# EAGLE design particle-can-v3.0 (EAGLE 7.5.0)
DATABASE: /home/monkbroc/Electronics/eagle/PARTSDB.tsv
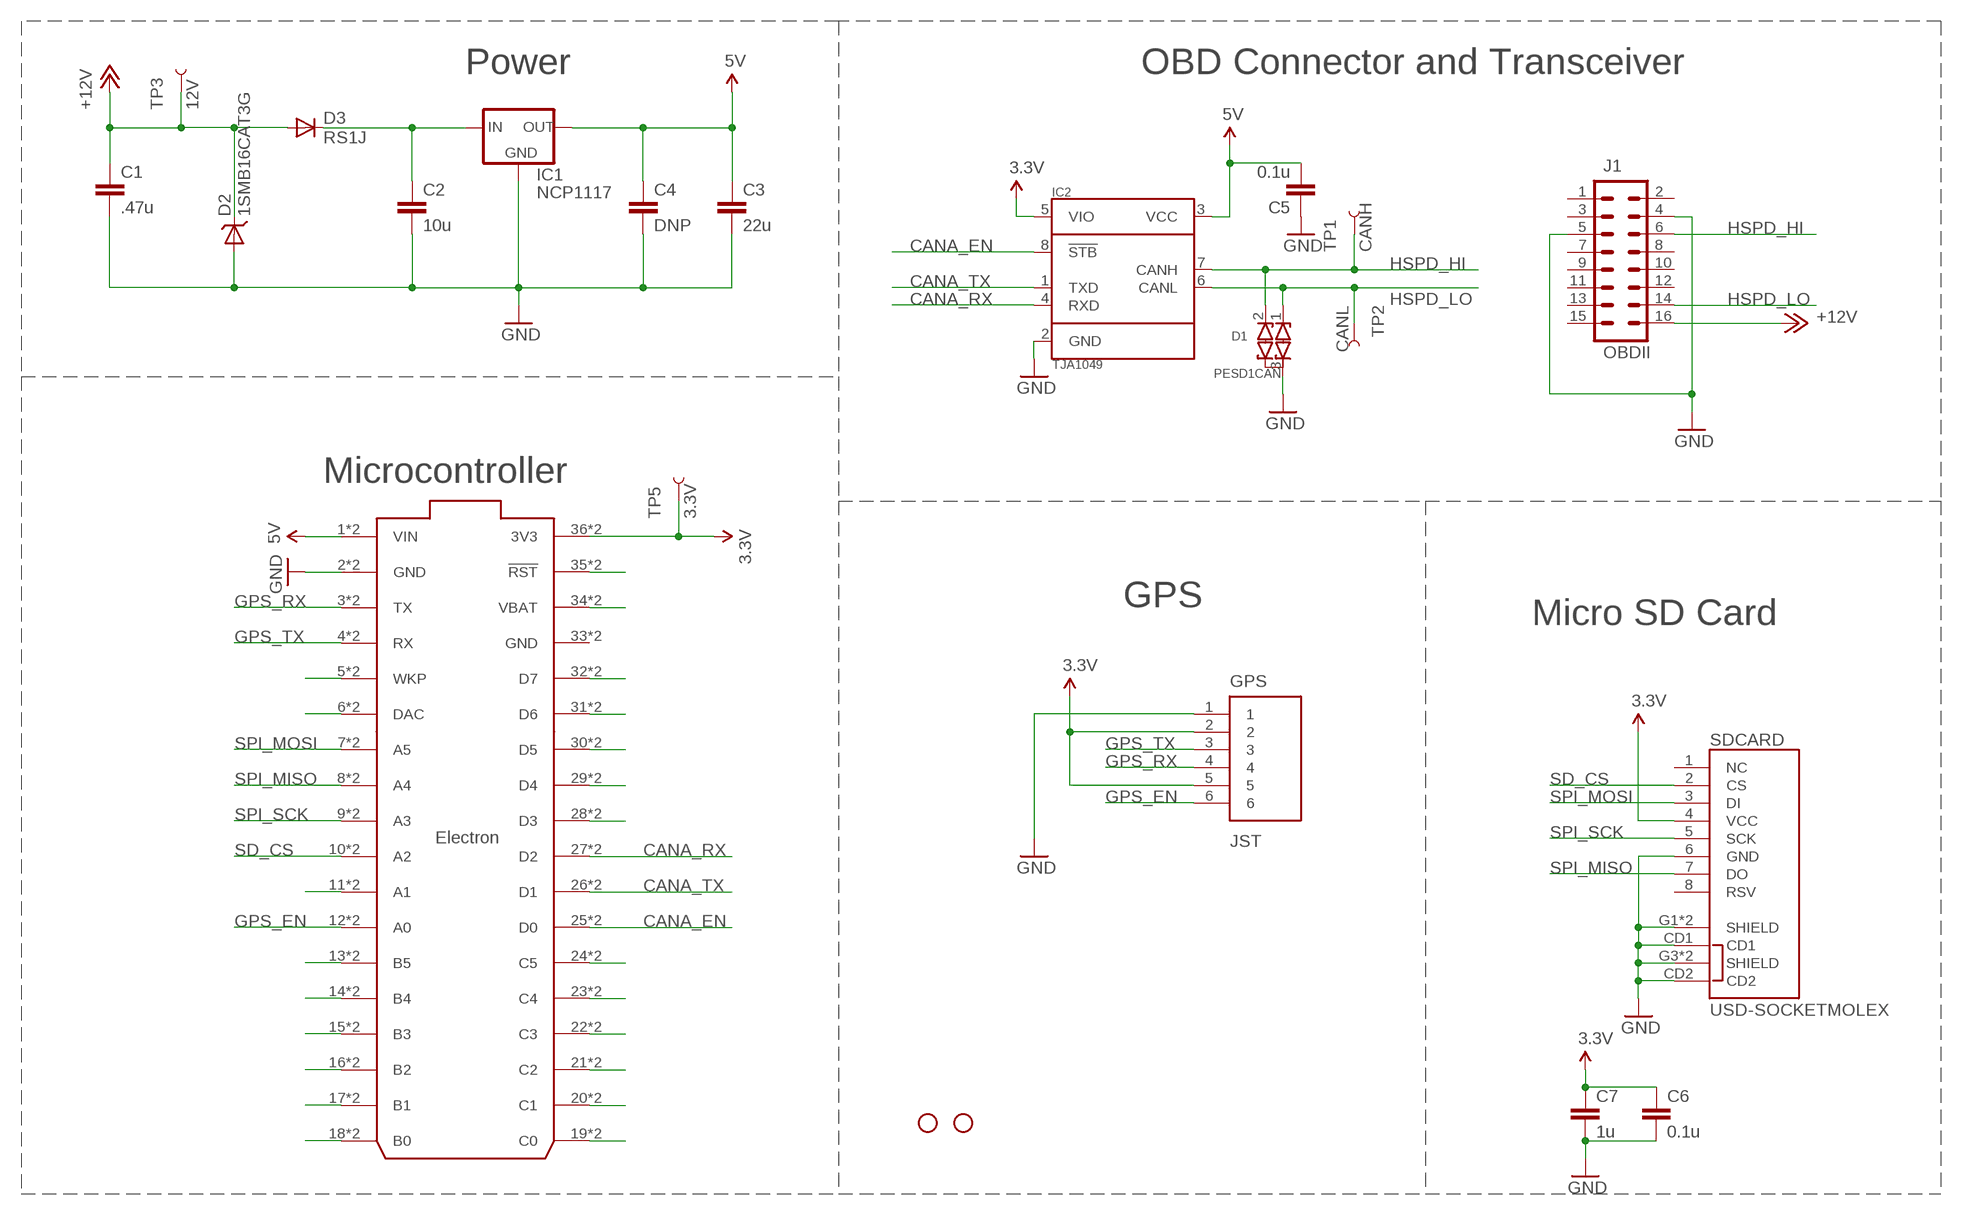
[diagram p0: schematic, sheet 1]

## Parts
C1  .47u  C-EUC0805  [C0805]
C2  10u  C-EUC0805  [C0805]
C3  22u  C-EUC0805  [C0805]
C4  DNP  C-EUC0805  [C0805]
C5  0.1u  C-EUC0805  [C0805]
C6  0.1u  C-EUC0805  [C0805]
C7  1u  C-EUC0805  [C0805]
D1  PESD1CAN  DIODE_ESD_DUAL-SOT-23  [SOT23]
D2  1SMB16CAT3G  DIODE-TVS-SMB  [SMB-DIODE]
D3  RS1J  DIODESMA  [SMA-DIODE]
ELECTRON  ELECTRON_WITH_EXTERNAL_HEADERS  [ELECTRON_EXTERNAL]
GPS  JST  [JST-6-SMD-VERT-1.0MM]
IC1  NCP1117  [SOT223]
IC2  TJA1049  [SO8]
J1  OBDII  M08X2-OBDII-COMTECH  [OBDII-COMTECH]
SDCARD  USD-SOCKETMOLEX  [MICRO-SD-MOLEX]
STANDOFF1  STAND-OFF  [STAND-OFF]
STANDOFF2  STAND-OFF  [STAND-OFF]
TP1  CANH  TEST-POINT3  [PAD.03X.03]
TP2  CANL  TEST-POINT3  [PAD.03X.03]
TP3  12V  TEST-POINT3  [PAD.03X.03]
TP5  3.3V  TEST-POINT3  [PAD.03X.03]

## Nets
3.3V: C6.1 C7.1 ELECTRON.36(3V3) ELECTRON.@36(3V3) GPS.2 GPS.5 IC2.5(VIO) SDCARD.4(VCC) TP5.P$1
5V [power]: C3.1 C4.1 C5.2 ELECTRON.1(VIN) ELECTRON.@1(VIN) IC1.3(OUT) IC1.4(OUT) IC2.3(VCC)
+12V [power]: C1.1 D2.C D3.A J1.16 TP3.P$1
CANA_EN: ELECTRON.25(D0) ELECTRON.@25(D0) IC2.8(!STB)
CANA_RX: ELECTRON.27(D2) ELECTRON.@27(D2) IC2.4(RXD)
CANA_TX: ELECTRON.26(D1) ELECTRON.@26(D1) IC2.1(TXD)
GND: C1.2 C2.2 C3.2 C4.2 C5.1 C6.2 C7.2 D1.3(COM) D2.A ELECTRON.2(GND) ELECTRON.@2(GND) GPS.1 IC1.1(GND) IC2.2(GND) J1.4 J1.5 SDCARD.6(GND) SDCARD.CD1 SDCARD.CD2 SDCARD.G1(SHIELD) SDCARD.G2(SHIELD) SDCARD.G3(SHIELD) SDCARD.G4(SHIELD)
GPS_EN: ELECTRON.12(A0) ELECTRON.@12(A0) GPS.6
GPS_RX: ELECTRON.3(TX) ELECTRON.@3(TX) GPS.4
GPS_TX: ELECTRON.4(RX) ELECTRON.@4(RX) GPS.3
HSPD_HI: D1.2(C2) IC2.7(CANH) J1.6 TP1.P$1
HSPD_LO: D1.1(C1) IC2.6(CANL) J1.14 TP2.P$1
N$1: ELECTRON.13(B5) ELECTRON.@13(B5)
N$7: ELECTRON.14(B4) ELECTRON.@14(B4)
N$10: ELECTRON.35(!RST) ELECTRON.@35(!RST)
N$11: ELECTRON.34(VBAT) ELECTRON.@34(VBAT)
N$12: ELECTRON.32(D7) ELECTRON.@32(D7)
N$13: ELECTRON.31(D6) ELECTRON.@31(D6)
N$14: ELECTRON.30(D5) ELECTRON.@30(D5)
N$15: ELECTRON.29(D4) ELECTRON.@29(D4)
N$16: ELECTRON.28(D3) ELECTRON.@28(D3)
N$17: ELECTRON.15(B3) ELECTRON.@15(B3)
N$18: ELECTRON.11(A1) ELECTRON.@11(A1)
N$19: ELECTRON.16(B2) ELECTRON.@16(B2)
N$20: ELECTRON.17(B1) ELECTRON.@17(B1)
N$21: ELECTRON.18(B0) ELECTRON.@18(B0)
N$22: ELECTRON.19(C0) ELECTRON.@19(C0)
N$23: ELECTRON.20(C1) ELECTRON.@20(C1)
N$24: ELECTRON.21(C2) ELECTRON.@21(C2)
N$25: ELECTRON.6(DAC) ELECTRON.@6(DAC)
N$26: ELECTRON.5(WKP) ELECTRON.@5(WKP)
N$27: ELECTRON.23(C4) ELECTRON.@23(C4)
N$28: ELECTRON.24(C5) ELECTRON.@24(C5)
N$29: ELECTRON.22(C3) ELECTRON.@22(C3)
N$31 [power]: C2.1 D3.C IC1.2(IN)
SD_CS: ELECTRON.10(A2) ELECTRON.@10(A2) SDCARD.2(CS)
SPI_MISO: ELECTRON.8(A4) ELECTRON.@8(A4) SDCARD.7(DO)
SPI_MOSI: ELECTRON.7(A5) ELECTRON.@7(A5) SDCARD.3(DI)
SPI_SCK: ELECTRON.9(A3) ELECTRON.@9(A3) SDCARD.5(SCK)
Unconnected: J1.1 J1.2 J1.3 J1.7 J1.8 J1.9 J1.10 J1.11 J1.12 J1.13 J1.15 SDCARD.1(NC) SDCARD.8(RSV)

## Notes on the sheet
- Power | OBD Connector and Transceiver
- Microcontroller
- GPS
- Micro SD Card

## Power pins joined to a net without a drawn wire
GND: ELECTRON.33(GND) ELECTRON.@33(GND)

## Library data of the parts
C1 = rcl:C-EU: CAPACITOR, European symbol; PARTNO: C0805C474K5RACTU
C2 = rcl:C-EU: CAPACITOR, European symbol; PARTNO: GRM21BR6YA106KE43L
C3 C4 = rcl:C-EU: CAPACITOR, European symbol; PARTNO: GRM219R61A226MEA0D
C5 C6 = rcl:C-EU: CAPACITOR, European symbol; PARTNO: 08055C104KAT2A
C7 = rcl:C-EU: CAPACITOR, European symbol; PARTNO: CC0805KKX7R7BB105
D1 = MuniRent:DIODE_ESD_DUAL: Dual ESD Diode, with a common anode; PARTNO: PESD1CAN-215
D2 = BUG:DIODE-TVS; PARTNO: 1SMB16CAT3G; ROLE: Overvoltage protection
D3 = BUG:DIODE: Diode These are standard reverse protection diodes and small signal diodes. SMA package can handle up to about 1A. SOD-323 can handle about 200mA. What the SOD-323 package when ordering, there are some mfgs out there that are 5-pin packages.; PARTNO: RS1J-E3/5AT; ROLE: Reverse protection
ELECTRON = MuniRent:ELECTRON; PARTNO: PPTC181LFBN-RC
GPS = MuniRent:JST; PARTNO: BM06B-SRSS-TB; PROD_ID: CONN-08249
IC1 = MuniRent:NCP1117; PARTNO: NCP1117LPST50T3G
IC2 = MuniRent:TJA1049; PARTNO: TJA1049T-118
J1 = MuniRent:M08X2: .1" headers, two rows of 8 each; PARTNO: OBD-II
SDCARD = MuniRent:USD-SOCKET: microSD Socket Push-push type uSD socket. Schematic element and footprint production proven. Spark Fun Electronics SKU : PRT-00127. tDoc lines correctly indicate media card edge positions when inserting (unlocked, locked, depressed). NOTE: CD1 and CD2 are connected internally; PARTNO: 1040310811
STANDOFF1 STANDOFF2 = SparkFun-Electromechanical:STAND-OFF: #4 Stand Off This is the mechanical footprint for a #4 phillips button head screw. Use the keepout ring to avoid running the screw head into surrounding components. SKU : PRT-00447
TP1-TP3 TP5 = SparkFun-Passives:TEST-POINT: Bare copper test points for troubleshooting or ICT

## Net classes
0 default: width 0.254 mm
1 power: width 0.813 mm, clearance 0.406 mm

## Board
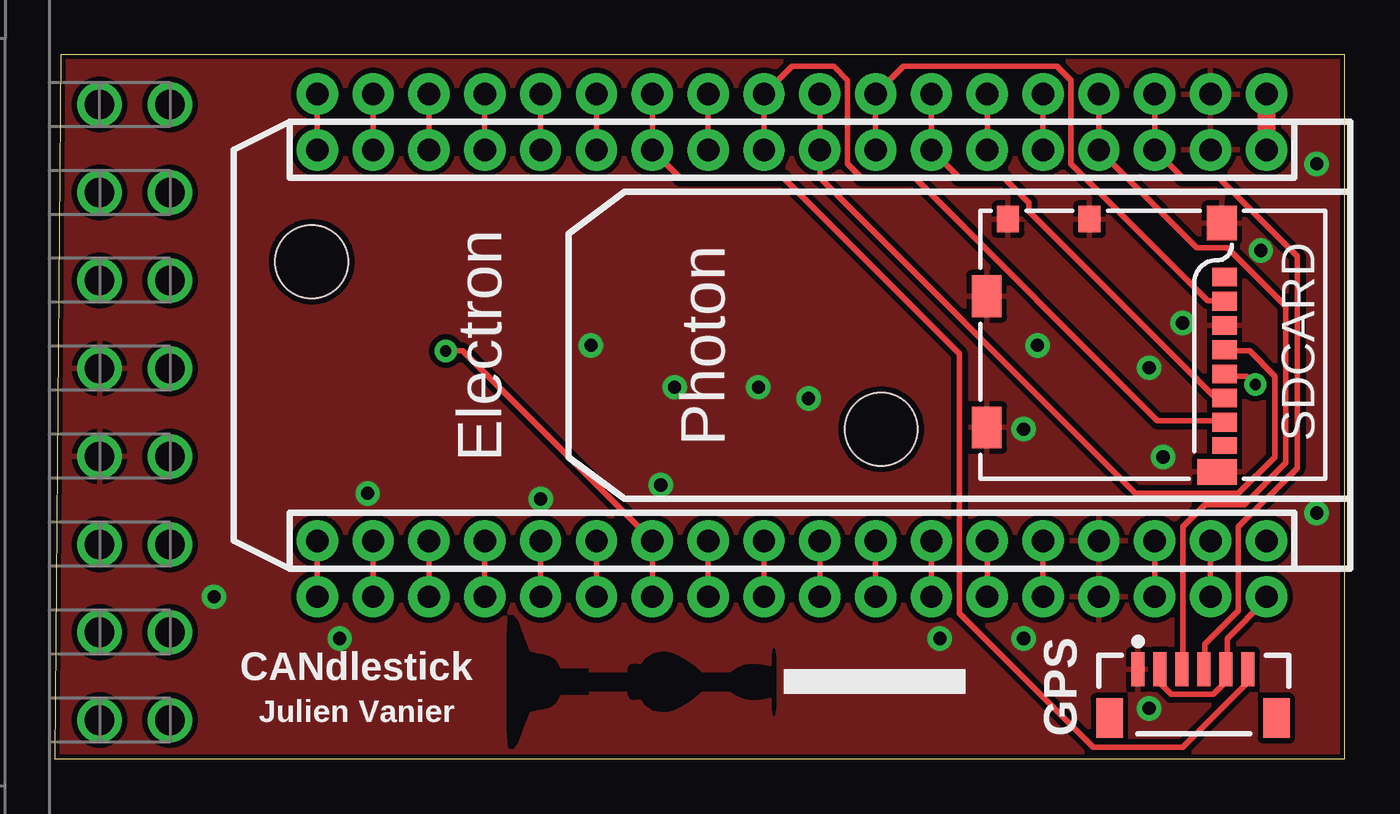
[diagram p1: board, top side]
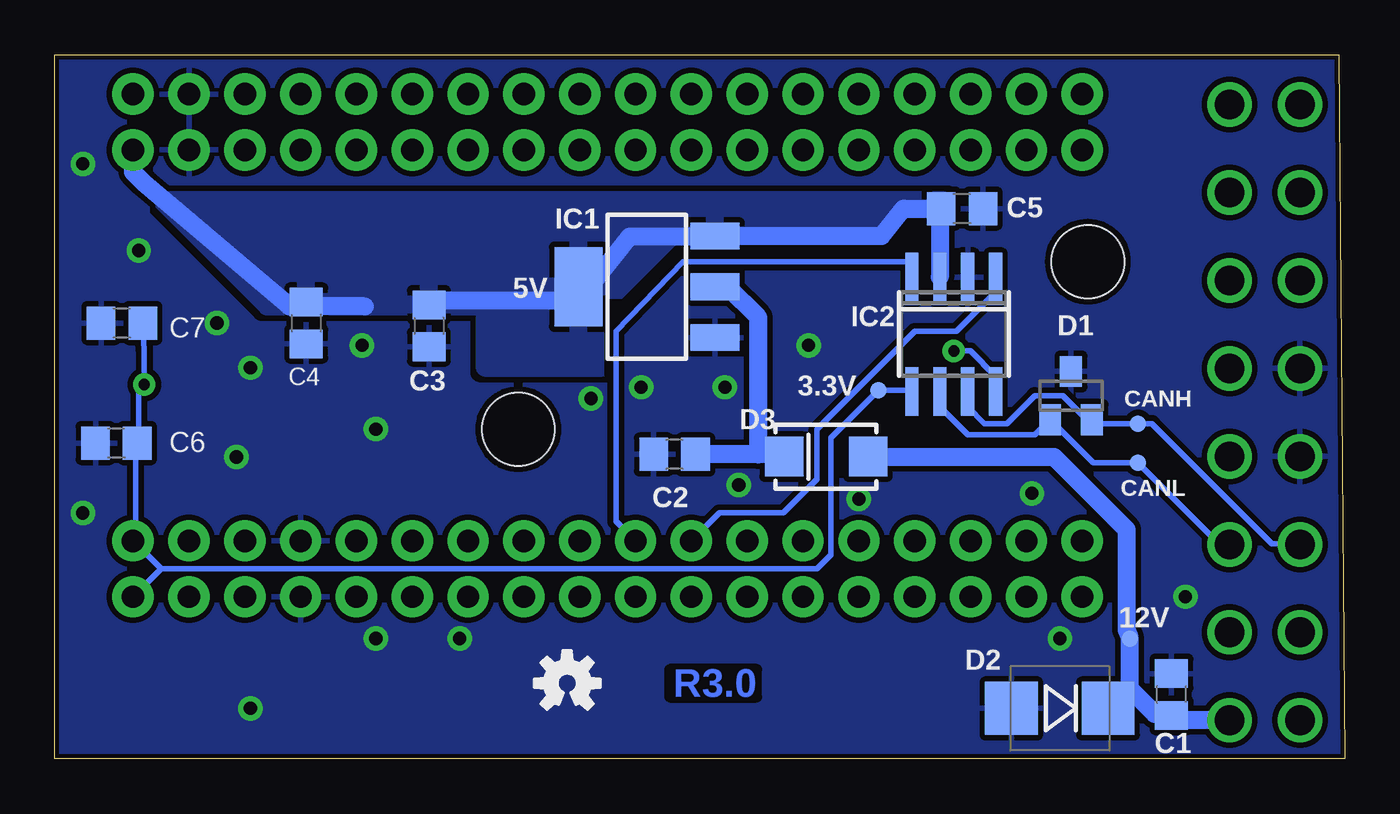
[diagram p2: board, bottom side, seen from below]

Size 58.67 x 32 mm. Coordinates in mm from the lower left corner, seen from the top.
Outline: 0,0 58.67,0 58.67,32 0.25,32 0,0
Copper layers (1*16): Top 0.035mm / dielectric 1.5mm / Bottom 0.035mm
Design rules "SparkFun *": minimum track width 8mil, minimum drill 20mil, track to track 10mil, track to pad 8mil, pad to pad 10mil, via to via 10mil, smd to smd 10mil, copper to edge 8mil, drill to drill 8mil, minimum pad ring 12mil, minimum via ring 10mil, stop-mask expansion 4mil, vias tented up to drill 45mil, thermal gap 10mil
tRestrict: area 20.5,0.4 to 32.8,6.5

### Footprints (pad centres in the part's own frame; a part is rotated, then mirrored left to right if it is on the bottom)
C0805 = smd 1.3 x 1.5: 1 -0.95,0; 2 0.95,0
SOT23 = smd 1 x 1.4: 1 -0.95,-1.1; 2 0.95,-1.1; 3 0,1.1
SMB-DIODE = smd 2.4 x 2.4: A 2.2,0; C -2.2,0
SMA-DIODE = smd 1.75 x 1.8: A -1.91,0; C 1.91,0
ELECTRON_EXTERNAL = drill 1.016 pad 1.88: 1 1.27,46.99; 2 1.27,44.45; 3 1.27,41.91; 4 1.27,39.37; 5 1.27,36.83; 6 1.27,34.29; 7 1.27,31.75; 8 1.27,29.21; 9 1.27,26.67; 10 1.27,24.13; 11 1.27,21.59; 12 1.27,19.05; 13 1.27,16.51; 14 1.27,13.97; 15 1.27,11.43; 16 1.27,8.89; 17 1.27,6.35; 18 1.27,3.81; 19 19.05,3.81; 20 19.05,6.35; 21 19.05,8.89; 22 19.05,11.43; 23 19.05,13.97; 24 19.05,16.51; 25 19.05,19.05; 26 19.05,21.59; 27 19.05,24.13; 28 19.05,26.67; 29 19.05,29.21; 30 19.05,31.75; 31 19.05,34.29; 32 19.05,36.83; 33 19.05,39.37; 34 19.05,41.91; 35 19.05,44.45; 36 19.05,46.99; @1 -1.27,46.99; @2 -1.27,44.45; @3 -1.27,41.91; @4 -1.27,39.37; @5 -1.27,36.83; @6 -1.27,34.29; @7 -1.27,31.75; @8 -1.27,29.21; @9 -1.27,26.67; @10 -1.27,24.13; @11 -1.27,21.59; @12 -1.27,19.05; @13 -1.27,16.51; @14 -1.27,13.97; @15 -1.27,11.43; @16 -1.27,8.89; @17 -1.27,6.35; @18 -1.27,3.81; @19 21.59,3.81; @20 21.59,6.35; @21 21.59,8.89; @22 21.59,11.43; @23 21.59,13.97; @24 21.59,16.51; @25 21.59,19.05; @26 21.59,21.59; @27 21.59,24.13; @28 21.59,26.67; @29 21.59,29.21; @30 21.59,31.75; @31 21.59,34.29; @32 21.59,36.83; @33 21.59,39.37; @34 21.59,41.91; @35 21.59,44.45; @36 21.59,46.99
JST-6-SMD-VERT-1.0MM = smd 0.6 x 1.55: 1 -2.54,1.27; 2 -1.54,1.27; 3 -0.54,1.27; 4 0.46,1.27; 5 1.46,1.27; 6 2.46,1.27 | smd 1.2 x 1.8: P$1 -3.84,-0.955; P$2 3.76,-0.955
SOT223 = smd 1.219 x 2.235: 1 -2.311,-3.099; 2 0,-3.099; 3 2.311,-3.099 | smd 3.6 x 2.2: 4 0,3.099
SO8 = smd 0.6 x 2.2: 1 -1.905,-2.6; 2 -0.635,-2.6; 3 0.635,-2.6; 4 1.905,-2.6; 5 1.905,2.6; 6 0.635,2.6; 7 -0.635,2.6; 8 -1.905,2.6
OBDII-COMTECH = drill 1.346: 1 -14,0; 2 -10,0; 3 -6,0; 4 -2,0; 5 2,0; 6 6,0; 7 10,0; 8 14,0; 9 -14,3.2; 10 -10,3.2; 11 -6,3.2; 12 -2,3.2; 13 2,3.2; 14 6,3.2; 15 10,3.2; 16 14,3.2
MICRO-SD-MOLEX = smd 0.75 x 1.1: 1 -4.545,0.25 | smd 0.85 x 1.1: 2 -3.495,0.25; 3 -2.395,0.25; 4 -1.295,0.25; 5 -0.195,0.25; 6 0.905,0.25; 7 2.005,0.25; 8 3.105,0.25 | smd 1.2 x 1: CD1 5.74,6.4; CD2 5.74,10.1 | smd 1.55 x 1.35: G1 5.565,0.375 | smd 1.17 x 1.8: G2 -5.755,0.6 | smd 1.9 x 1.35: G3 -3.735,11.075; G4 2.235,11.075
STAND-OFF = hole 3.302: 0,0
PAD.03X.03 = smd 0.762 x 0.762: P$1 0,0

### Placement (x,y rotation side)
C1  7.87,2.92 90 bottom
C2  30.48,13.84 180 bottom
C3  41.66,19.68 270 bottom
C4  47.24,19.81 270 bottom
C5  17.4,25.02 180 bottom
C6  55.88,14.35 180 bottom
C7  55.63,19.81 180 bottom
D1  12.45,16.51 0 bottom
D2  12.95,2.29 180 bottom
D3  23.59,13.74 180 bottom
ELECTRON  8.13,28.96 270 top
F2  [OSHW-LOGO-S]  35.37,3.43 0 bottom
GPS  51.82,2.79 0 top
IC1  31.75,21.46 90 bottom
IC2  17.78,19.3 180 bottom
J1  2.03,15.75 270 top
SDCARD  53.47,18.8 90 top
STANDOFF1  11.68,22.61 0 top
STANDOFF2  37.59,14.99 0 top
TP1  9.4,15.24 0 bottom
TP2  9.4,13.46 0 bottom
TP3  9.78,5.46 0 bottom
TP5  21.21,16.76 0 bottom
ZDRAW1  [A4L-LOC]  -55.68,-52.84 0 top  (outside the outline)

### Tracks (layer width: path | path; a pad name or v marks a point on that pad's centre or on a via)
3.3V  (via drill 0.51)
  Top 0.254: GPS.2 50.29,4.06 50.29,3.43 50.8,2.92 52.7,2.92 53.21,3.43 53.21,4.06 GPS.5 53.34,4.06 53.34,5.46 55.12,7.24 ELECTRON.@36 | v54.61,17.02 54.23,17.4 53.34,17.4 SDCARD.4
  Bottom 0.254: C7.1 54.61,18.54 v54.61,17.02 54.86,16.76 54.86,13.72 C6.1 54.99,13.72 54.99,9.91 ELECTRON.36 53.85,8.64 | IC2.5 19.68,16.76 TP5.P$1 23.37,14.61 23.37,9.27 24,8.64 53.85,8.64 | 53.85,8.64 ELECTRON.@36
5V
  Top 0.813: ELECTRON.@1 ELECTRON.1
  Bottom 0.813: 41.78,20.45 41.66,20.57 C3.1 41.27,20.83 35.05,20.83 34.92,20.95 IC1.4 34.54,21.21 32.51,23.75 28.7,23.75 IC1.3 21.06,23.77 20.07,25.02 C5.2 18.41,24.95 IC2.3 | ELECTRON.1 55.12,26.67 54.61,26.16 48.01,20.57 47.24,20.57 | 44.58,20.57 47.24,20.57 | C4.1 47.24,20.57
  pour Bottom (isolate 0.406): 18.29,25.4 53.85,25.4 49.02,20.57 39.37,20.57 39.12,20.32 39.12,17.78 33.78,17.78 33.78,20.57 30.23,24.13 21.08,24.13 20.57,24.64 20.57,24.89 20.32,25.15 18.54,25.15
+12V
  Bottom 0.813: 9.78,3.17 TP3.P$1 9.91,5.84 9.91,10.41 13.21,13.72 21.59,13.72 D3.A | 9.78,3.17 10.67,2.29 D2.C | 9.78,3.17 8.64,2.03 7.87,2.03 C1.1 7.49,1.78 5.33,1.78 J1.16
CANA_EN  (via drill 0.51)
  Top 0.254: v17.78,18.54 18.54,18.54 ELECTRON.25 ELECTRON.@25
  Bottom 0.254: IC2.8 15.88,17.4 17.02,18.54 v17.78,18.54
CANA_RX
  Top 0.254: ELECTRON.27 ELECTRON.@27
  Bottom 0.254: ELECTRON.27 33.15,10.79 33.15,19.43 30.1,22.61 19.68,22.61 IC2.4
CANA_TX
  Top 0.254: ELECTRON.26 ELECTRON.@26
  Bottom 0.254: IC2.1 15.88,21.21 17.65,19.43 19.56,19.43 24,14.99 24,12.7 25.53,11.18 28.45,11.18 ELECTRON.26
GND  (via drill 0.6)
  other vias: 12.95,5.46 7.24,7.37 14.22,12.06 22.1,11.81 27.56,12.45 24.38,18.8 28.19,16.89 32,16.89 34.29,16.38 44.7,18.8 44.07,14.99 50.42,13.72 54.86,23.11 57.4,11.18 57.4,27.05 49.78,2.29 44.07,5.46 40.26,5.46 49.78,17.78 51.31,19.81
  pour Top (rank 4): 0.25,0 58.67,0 58.67,32 0.25,32
  pour Bottom (rank 5): 0.25,0 58.67,0 58.67,32 0.25,32
GPS_EN
  Top 0.254: GPS.6 54.23,4.06 54.23,3.43 51.31,0.51 47.24,0.51 41.15,6.6 41.15,18.41 33.15,26.42 28.45,26.42 ELECTRON.12 ELECTRON.@12
GPS_RX
  Top 0.254: GPS.4 52.32,4.06 52.32,5.21 53.85,6.73 53.85,10.54 56.52,13.21 56.52,22.86 52.96,26.42 51.31,26.42 ELECTRON.3 ELECTRON.@3
GPS_TX
  Top 0.254: GPS.3 51.31,4.06 51.31,10.54 52.32,11.56 54.1,11.56 56.01,13.46 56.01,20.57 53.34,23.24 51.94,23.24 ELECTRON.4 ELECTRON.@4
HSPD_HI
  Bottom 0.254: IC2.7 17.14,16 16.38,15.24 15.37,15.24 14.1,16.51 12.83,16.51 11.81,15.49 11.56,15.49 D1.2 11.43,15.37 11.3,15.24 TP1.P$1 8.76,15.24 3.3,9.78 2.03,9.78 J1.6
HSPD_LO
  Bottom 0.254: IC2.6 18.41,16 17.14,14.73 14.1,14.73 13.46,15.37 D1.1 13.34,15.37 11.43,13.46 TP2.P$1 5.71,9.78 5.33,9.78 J1.14
N$1
  Top 0.254: ELECTRON.@13 ELECTRON.13
N$7
  Top 0.254: ELECTRON.@14 ELECTRON.14
N$10
  Top 0.254: ELECTRON.35 ELECTRON.@35
N$11
  Top 0.254: ELECTRON.34 ELECTRON.@34
N$12
  Top 0.254: ELECTRON.32 ELECTRON.@32
N$13
  Top 0.254: ELECTRON.31 ELECTRON.@31
N$14
  Top 0.254: ELECTRON.30 ELECTRON.@30
N$15
  Top 0.254: ELECTRON.29 ELECTRON.@29
N$16
  Top 0.254: ELECTRON.28 ELECTRON.@28
N$17
  Top 0.254: ELECTRON.@15 ELECTRON.15
N$18
  Top 0.254: ELECTRON.@11 ELECTRON.11
N$19
  Top 0.254: ELECTRON.@16 ELECTRON.16
N$20
  Top 0.254: ELECTRON.@17 ELECTRON.17
N$21
  Top 0.254: ELECTRON.@18 ELECTRON.18
N$22
  Top 0.254: ELECTRON.19 ELECTRON.@19
N$23
  Top 0.254: ELECTRON.20 ELECTRON.@20
N$24
  Top 0.254: ELECTRON.21 ELECTRON.@21
N$25
  Top 0.254: ELECTRON.@6 ELECTRON.6
N$26
  Top 0.254: ELECTRON.@5 ELECTRON.5
N$27
  Top 0.254: ELECTRON.23 ELECTRON.@23
N$28
  Top 0.254: ELECTRON.24 ELECTRON.@24
N$29
  Top 0.254: ELECTRON.22 ELECTRON.@22
N$31
  Bottom 0.813: 26.67,13.84 25.53,13.84 D3.C | 26.67,13.84 C2.1 | IC1.2 28.07,21.46 26.67,20.07 26.67,13.84
SD_CS
  Top 0.254: SDCARD.2 53.21,15.37 50.16,15.37 39.12,26.42 36.7,26.42 36.07,27.05 36.07,30.86 35.43,31.5 33.53,31.5 ELECTRON.@10 ELECTRON.10
SPI_MISO
  Top 0.254: SDCARD.7 53.21,20.83 52.45,20.83 46.23,27.05 46.23,30.86 45.59,31.5 38.61,31.5 ELECTRON.@8 ELECTRON.8
SPI_MOSI
  Top 0.254: SDCARD.3 53.21,16.51 52.7,16.51 44.32,24.89 44.32,25.27 43.18,26.42 41.15,26.42 ELECTRON.7 ELECTRON.@7
SPI_SCK
  Top 0.254: SDCARD.5 53.34,18.54 54.36,18.54 55.5,17.4 55.5,13.72 53.85,12.06 49.15,12.06 34.8,26.42 ELECTRON.9 ELECTRON.@9

### Text on the board
Bottom: R3.0
tPlace: CANdlestick | Julien Vanier
bPlace: 5V | 3.3V | CANH | CANL | 12V
Document: NOTES: | Revision 3.0 | Julien Vanier | jvanier@gmail.com